# Altium schematic sheet Funtional Block Diagram Power Section.SchDoc
size A4; SheetNumber: 5; SheetTotal: 5
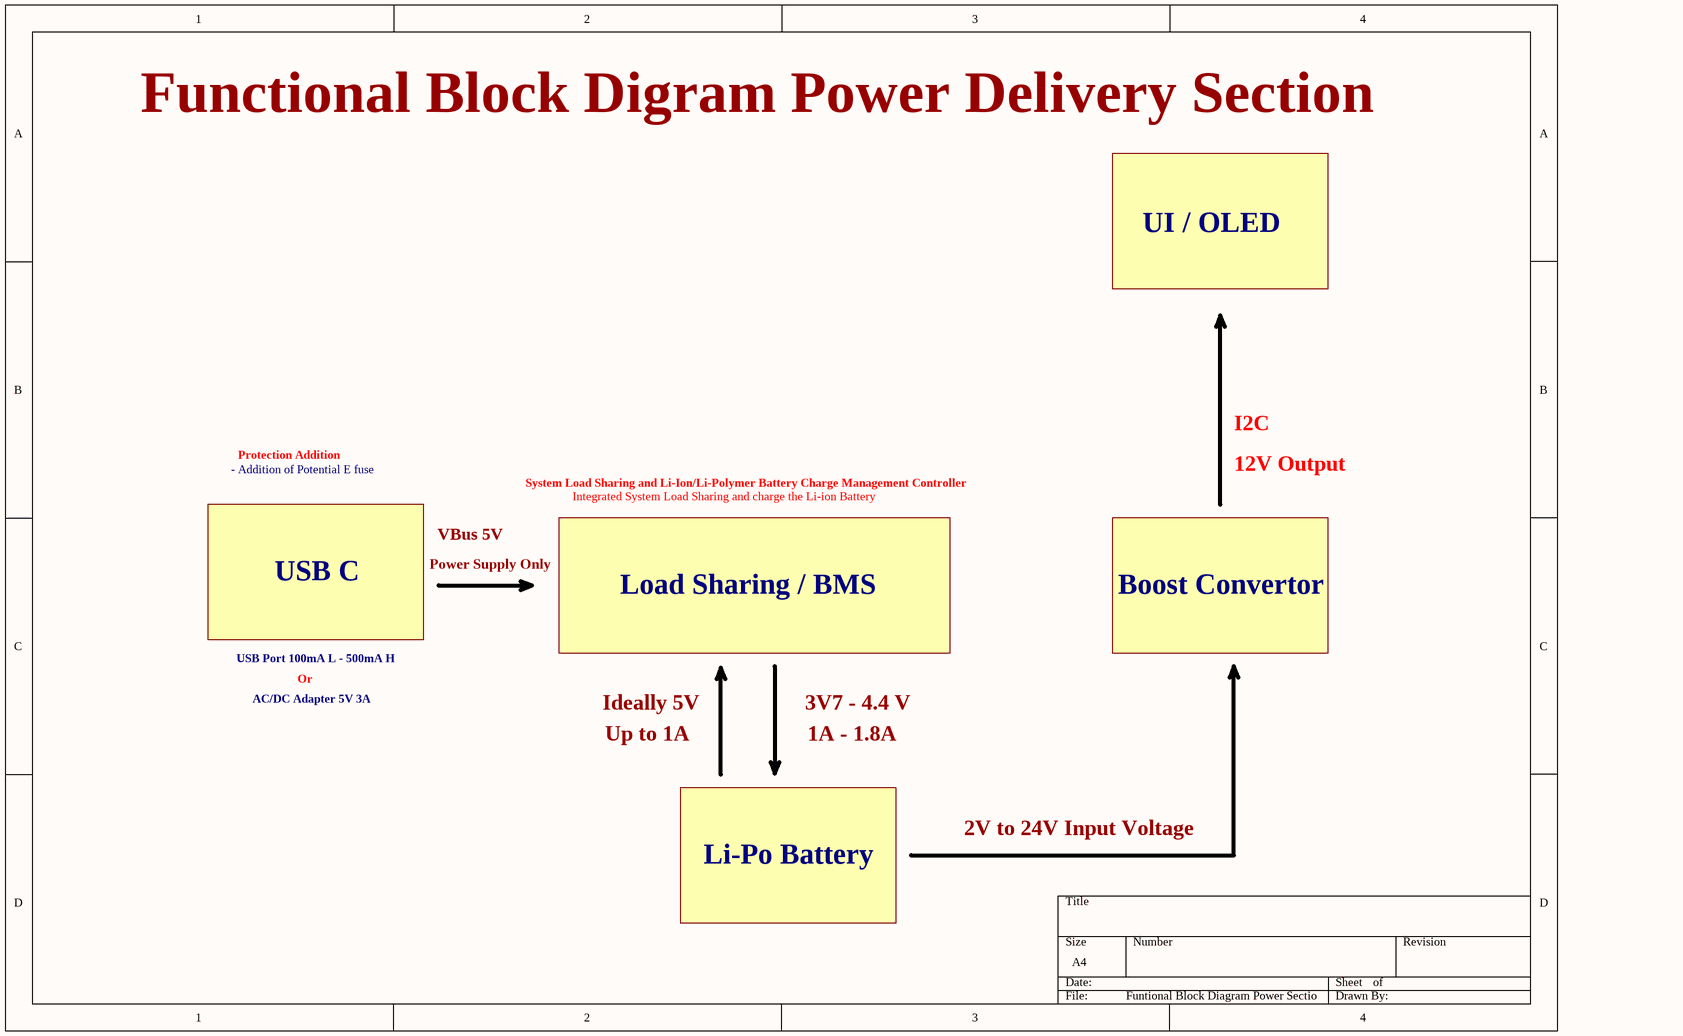
[diagram p0: Funtional Block Diagram Power Section.SchDoc]

## Notes on the sheet
- Functional Block Digram Power Delivery Section
- UI / OLED
- I2C
- - Addition of Potential E fuse
- Protection Addition
- System Load Sharing and Li-Ion/Li-Polymer Battery Charge Management Controller
- Integrated System Load Sharing and charge the Li-ion Battery
- 12V Output
- USB C
- Power Supply Only
- VBus 5V
- Load Sharing / BMS
- Boost Convertor
- USB Port 100mA L - 500mA H
- AC/DC Adapter 5V 3A
- Or
- Ideally 5V
- 3V7 - 4.4 V
- Up to 1A
- 1A - 1.8A
- 2V to 24V Input Voltage
- Li-Po Battery